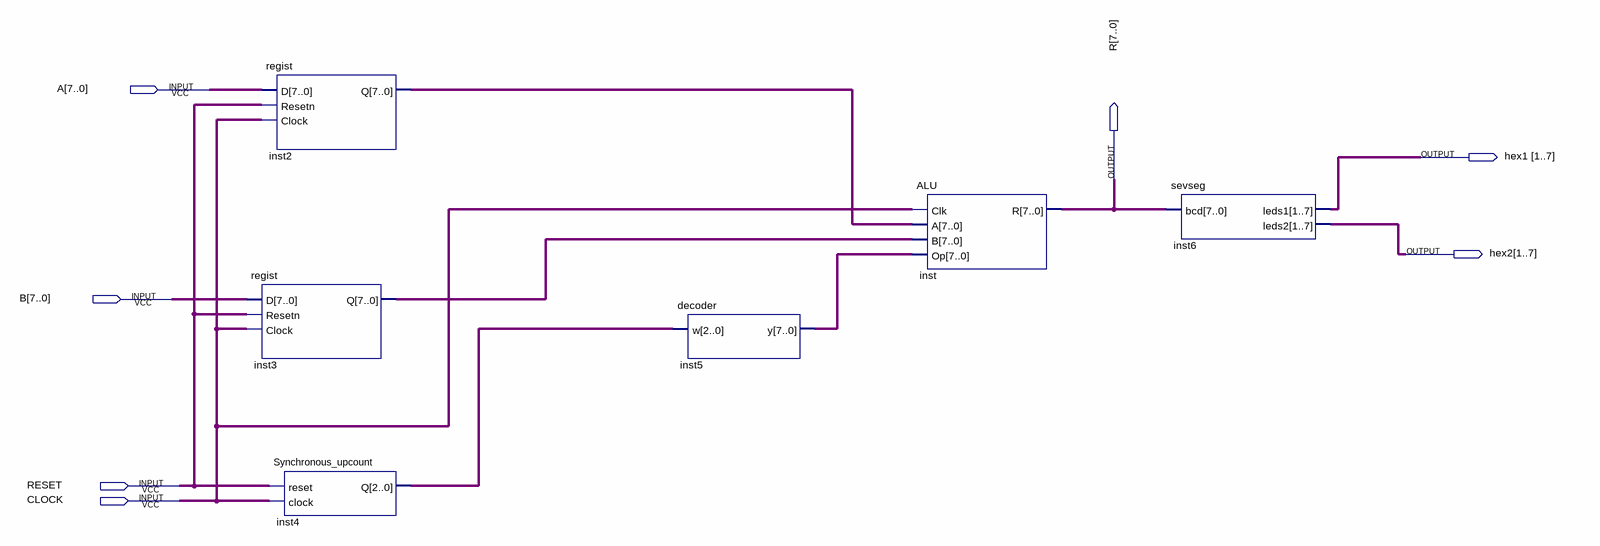
[diagram p0: schematic sheet]
// Quartus schematic MainProject.bdf as structural Verilog: 6 symbols, 7 pins
module MainProject (
  input  [7:0] A,
  input  [7:0] B,
  input  RESET,
  input  CLOCK,
  output [1:7] hex1,
  output [7:0] R,
  output [1:7] hex2
);

  wire [2:0] inst4_q;
  wire [7:0] inst2_q, inst3_q, inst5_y;

  regist inst3 (.D(B), .Resetn(RESET), .Clock(CLOCK), .Q(inst3_q));
  regist inst2 (.D(A), .Resetn(RESET), .Clock(CLOCK), .Q(inst2_q));
  Synchronous_upcount inst4 (.reset(RESET), .clock(CLOCK), .Q(inst4_q));
  decoder inst5 (.w(inst4_q), .y(inst5_y));
  ALU inst (.Clk(CLOCK), .A(inst2_q), .B(inst3_q), .Op(inst5_y), .R(R));
  sevseg inst6 (.bcd(R), .leds1(hex1), .leds2(hex2));
endmodule
